# EAGLE design pc_fan_pwm (EAGLE 7.1.0)
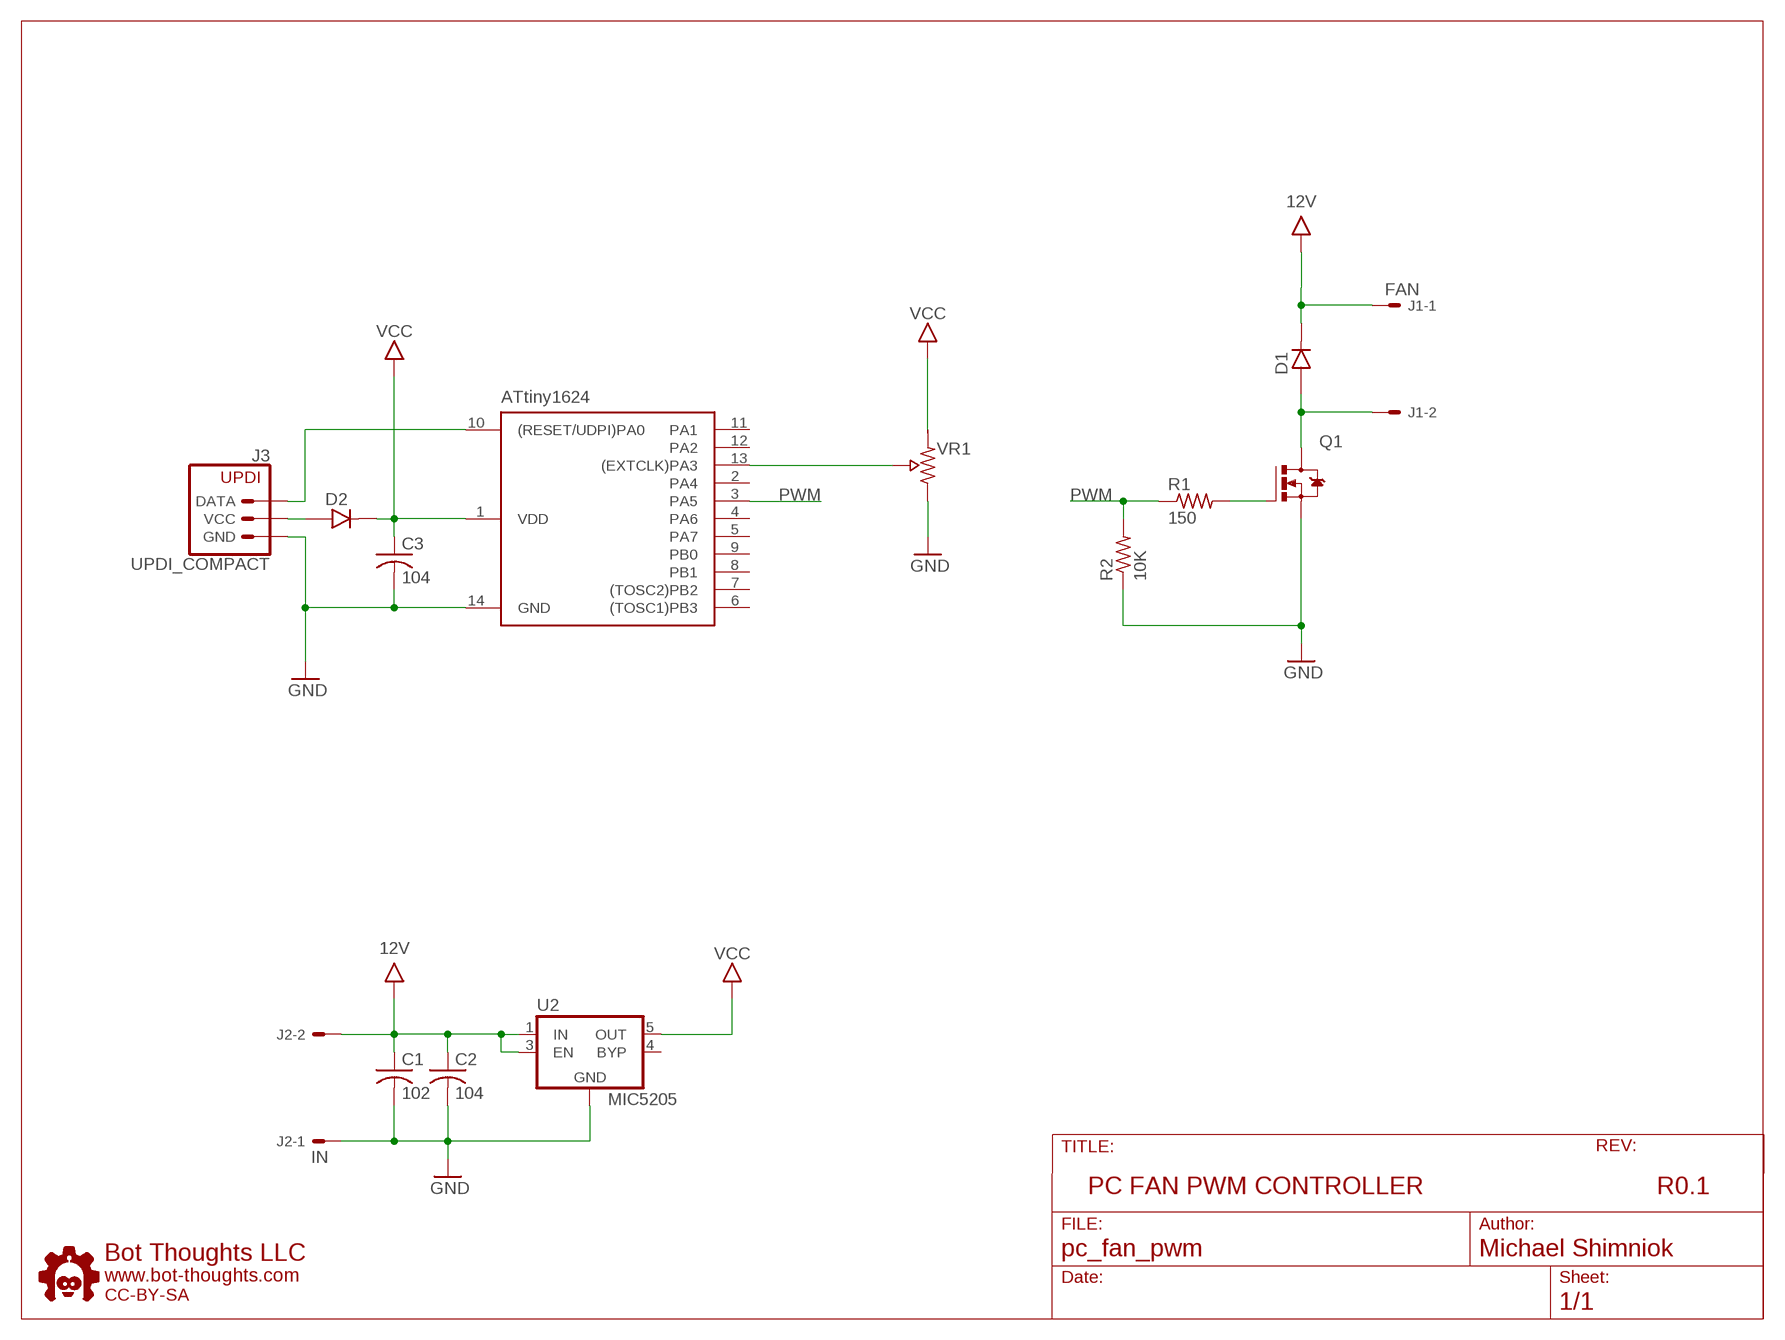
[diagram p0: schematic, sheet 1]

## Parts
C1  102  C-0603  [0603]
C2  104  C-0603  [0603]
C3  104  C-0603  [0603]
D1  DIODE_SOD323  [SOD-323]
D2  DIODE_SOD323  [SOD-323]
J1  FAN  22-05-7038-03  [7395-03]
J2  IN  22-05-7038-03  [7395-03]
J3  UPDI_COMPACT  [UPDI_1X3]
Q1  2N7000  [TO92D-]
R1  150  R0603  [0603]
R2  10K  R0603  [0603]
U1  ATTINY1624-SSU  [SOIC14N]
U2  MIC5205  [SOT23-5]
U$6  BTLOGO-LOGO-SM  [BTLOGOS]
VR1  TRIM-2X2.5  [POT_0.2X0.25]

## Nets
12V: C1.1(+) C2.1(+) J2.2 U2.1(IN) U2.3(EN)
FAN+: D1.C J1.1
GND: C1.2(-) C2.2(-) C3.2(-) J2.1 J3.2(GND) Q1.1(S) R2.1 U1.14(GND) U2.2(GND) VR1.A
N$1: Q1.2(G) R1.2
N$2: U1.13((EXTCLK)PA3) VR1.W(WIPER)
N$4: D1.A J1.2 Q1.3(D)
N$7: J3.3(DATA) U1.10((RESET/UDPI)PA0)
PWM: R1.1 R2.2 U1.3(PA5)
VCC: C3.1(+) D2.C U1.1(VDD) U2.5(OUT) VR1.B
VIN: D2.A J3.1(VCC)
Unconnected: J1.3 J2.3 U1.2(PA4) U1.4(PA6) U1.5(PA7) U1.6((TOSC1)PB3) U1.7((TOSC2)PB2) U1.8(PB1) U1.9(PB0) U1.11(PA1) U1.12(PA2) U2.4(BYP)

## Notes on the sheet
- PC FAN PWM CONTROLLER | R0.1

## Library data of the parts
C1-C3 = bt_rcl:C: Capacitor, non-polarized, American symbol
D1 D2 = bt_diode:DIODE: Diode Collection of generic diodes in various packages
J1 J2 = con-molex:22-?-03: CONNECTOR wire to board 2.54 mm (.1 inch) pitch header; OC_FARNELL: unknown; OC_NEWARK: unknown
J3 = bt_avr:UPDI: AVR UPDI - Unified Program and Debug Interface UPDI is a Microchip proprietary interface for external programming and on-chip debugging of a device. It is a successor to the PDI two-wire physical interface, which is found on all AVR XMEGA devices. UPDI is a one-wire interface providing a bidirectional half-duplex asynchronous communication with the target device for purposes of programming and debugging. UPDI Physical Interface <https://onlinedocs.microchip.com/pr/GUID-DDB0017E-84E3-4E77-AAE9-7AC4290E5E8B-en-US-4/index.html?GUID-9B349315-2842-4189-B88C-49F4E1055D7F>
Q1 = ads4:2N7000: 2N7000 N-Channel Logic-Level MOSFET
R1 R2 = bt_rcl:R: Resistor, American symbol
U1 = bt_avr:ATTINY1624: ATtiny1624 The ATtiny1624 microcontrollers of the tinyAVR ® 2 family use the AVR ® CPU with hardware multiplier, running at up to 20 MHz, with 16 KB Flash, 2 KB of SRAM, and 256B of EEPROM available in a 14-pin package. The family uses the latest technologies from Microchip with a flexible and low-power architecture, including Event System, advanced digital peripherals, and accurate analog features such as a 12-bit differential ADC with Programmable Gain Amplifier (PGA). datasheet.pdf <https://ww1.microchip.com/downloads/en/DeviceDoc/ATtiny1624-26-27-DataSheet-DS40002234A.pdf>
U2 = bt_regulator:MIC5205: ULDO Voltage regulator Voltage input: 2.5-16V Guaranteed 150mA output Low dropout voltage: < 350mV @ 150mA, < 70mV @ 50mA High output voltage accuracy (1%) Ultra-low-noise output Low quiescent current Reverse-battery protection “Zero” off-mode current Logic-controlled electronic enable The MIC5205 is an efficient linear voltage regulator with ultra low-noise output, very low dropout voltage (typically 17mV at light loads and 165mV at 150mA), and very low ground current (600⎧A at 100mA output). The MIC5205 offers better than 1% initial accuracy. Designed especially for hand-held, battery-powered devices, the MIC5205 includes a CMOS or TTL compatible enable/shutdown control input. When shut down, power consumption drops nearly to zero. Regulator ground current increases only slightly in dropout, further prolonging battery life. Key MIC5205 features include a reference bypass pin to improve its already excellent low-noise performance, reversed-battery protection, current limiting, and overtemperature shutdown. datasheet.pdf <http://www.micrel.com/_PDF/mic5205.pdf>
U$6 = bt:BTLOGO: Bot Thoughts Logo
VR1 = bt_electromech:TRIM-: POTENTIOMETER

## Board
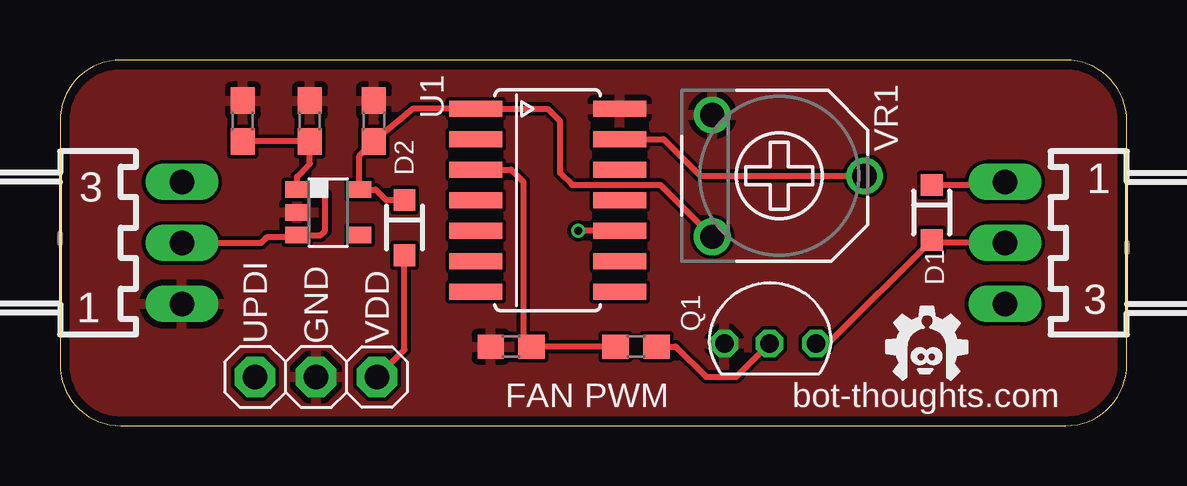
[diagram p1: board, top side]
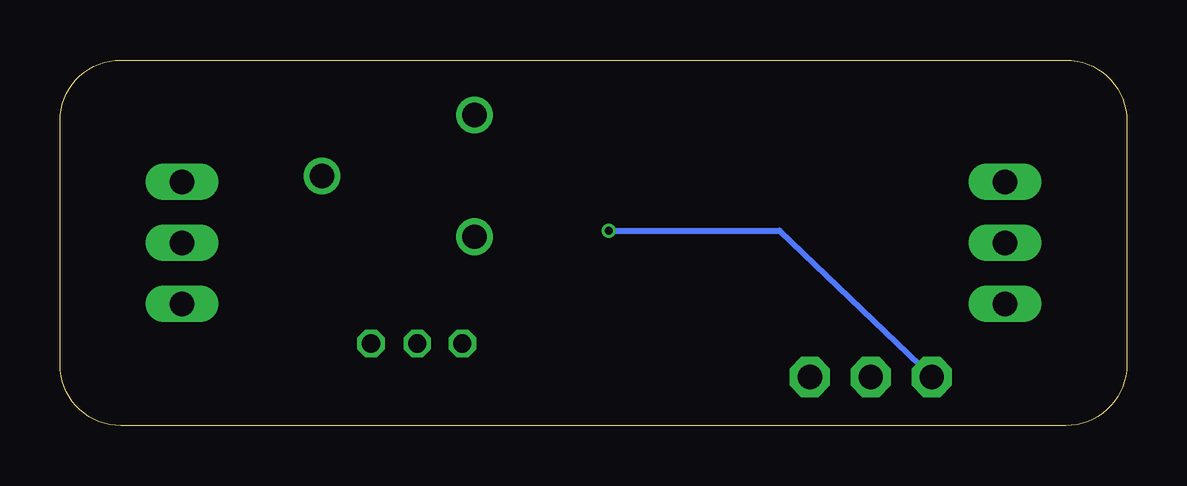
[diagram p2: board, bottom side, seen from below]

Size 44.45 x 15.24 mm. Coordinates in mm from the lower left corner, seen from the top.
Outline: 0,12.7 0,2.54 arc90 2.54,0 41.91,0 arc90 44.45,2.54 44.45,12.7 arc90 41.91,15.24 2.54,15.24 arc90 0,12.7
Copper layers (1*16): Top 0.035559375mm / dielectric 1.6mm / Bottom 0.035559375mm
Design rules "oshpark-2layer": minimum track width 6mil, minimum drill 10mil, track to track 6mil, track to pad 6mil, pad to pad 6mil, via to via 6mil, smd to smd 0mil, copper to edge 15mil, drill to drill 6mil, minimum pad ring 5mil, minimum via ring 5mil, stop-mask expansion 2.5mil, vias tented up to drill 0mil, thermal gap 10mil

### Footprints (pad centres in the part's own frame; a part is rotated, then mirrored left to right if it is on the bottom)
0603 = smd 1.1 x 1: 1 -0.85,0; 2 0.85,0
SOD-323 = smd 0.9 x 0.9: A 1.15,0; C -1.15,0
7395-03 = drill 1.016 long: 1 2.54,0; 2 0,0; 3 -2.54,0
UPDI_1X3 = drill 1.016 pad 1.676 octagon: 1 0,2.54; 2 0,0; 3 0,-2.54
TO92D- = drill 0.762 octagon: 1 -1.905,0; 2 -0.025,0; 3 1.905,0
SOIC14N = smd 0.66 x 2.2: 1 -3.81,-3; 2 -2.54,-3; 3 -1.27,-3; 4 0,-3; 5 1.27,-3; 6 2.54,-3; 7 3.81,-3; 8 3.81,3; 9 2.54,3; 10 1.27,3; 11 0,3; 12 -1.27,3; 13 -2.54,3; 14 -3.81,3
SOT23-5 = smd 0.69 x 0.99: 1 -0.95,-1.3; 2 0,-1.3; 3 0.95,-1.3; 4 0.95,1.3; 5 -0.95,1.3
POT_0.2X0.25 = drill 1.016: A -2.54,-2.54; B 2.54,-2.54; W 0,3.81

### Placement (x,y rotation side)
C1  7.62,12.7 90 top
C2  10.41,12.7 90 top
C3  13.08,12.7 90 top
D1  36.32,8.89 270 top
D2  14.35,8.26 270 top
J1  39.37,7.62 90 top
J2  5.08,7.62 270 top
J3  10.67,2.03 270 top
Q1  29.59,3.43 0 top
R1  24,3.3 0 top
R2  18.8,3.3 0 top
U1  20.32,9.4 270 top
U2  11.18,8.89 270 top
U$6  36.07,1.78 0 top
VR1  29.72,10.41 270 top

### Tracks (layer width: path | path; a pad name or v marks a point on that pad's centre or on a via)
12V
  Top 0.254: J2.2 8.38,7.62 8.64,7.87 9.81,7.87 U2.3 10.86,7.94 11.05,8.13 11.05,9.65 10.86,9.84 U2.1 9.88,10.38 10.41,10.92 C2.1 C1.1
FAN+
  Top 0.254: D1.C 39.5,10.04 J1.1
GND
  pour Top: 2.54,15.24 41.91,15.24 arc-90 44.45,12.7 44.45,2.54 arc-90 41.91,0 2.54,0 arc-90 0,2.54 0,12.7 arc-90
N$1
  Top 0.254: R1.2 25.65,3.3 26.92,2.03 28.17,2.03 Q1.2
N$2
  Top 0.254: U1.13 25.15,11.94 26.67,10.41 VR1.W
N$4
  Top 0.254: J1.2 36.44,7.62 D1.A 32.01,3.43 Q1.3
N$7  (via drill 0.33)
  Top 0.254: U1.10 v21.59,8.13
  Bottom 0.254: v21.59,8.13 14.48,8.13 J3.3
PWM
  Top 0.254: U1.3 18.8,10.67 19.3,10.16 19.3,3.47 R2.2 R1.1
VCC
  Top 0.254: VR1.B 25.02,10.03 21.34,10.03 20.83,10.54 20.83,12.7 20.32,13.21 U1.1 14.69,13.21 C3.1 12.48,11.24 U2.5 13.15,9.84 13.59,9.4 D2.C
VIN
  Top 0.254: J3.1 14.35,3.17 D2.A

### Text on the board
tNames: FAN PWM | bot-thoughts.com